# Altium schematic sheet ports.SchDoc
size A4
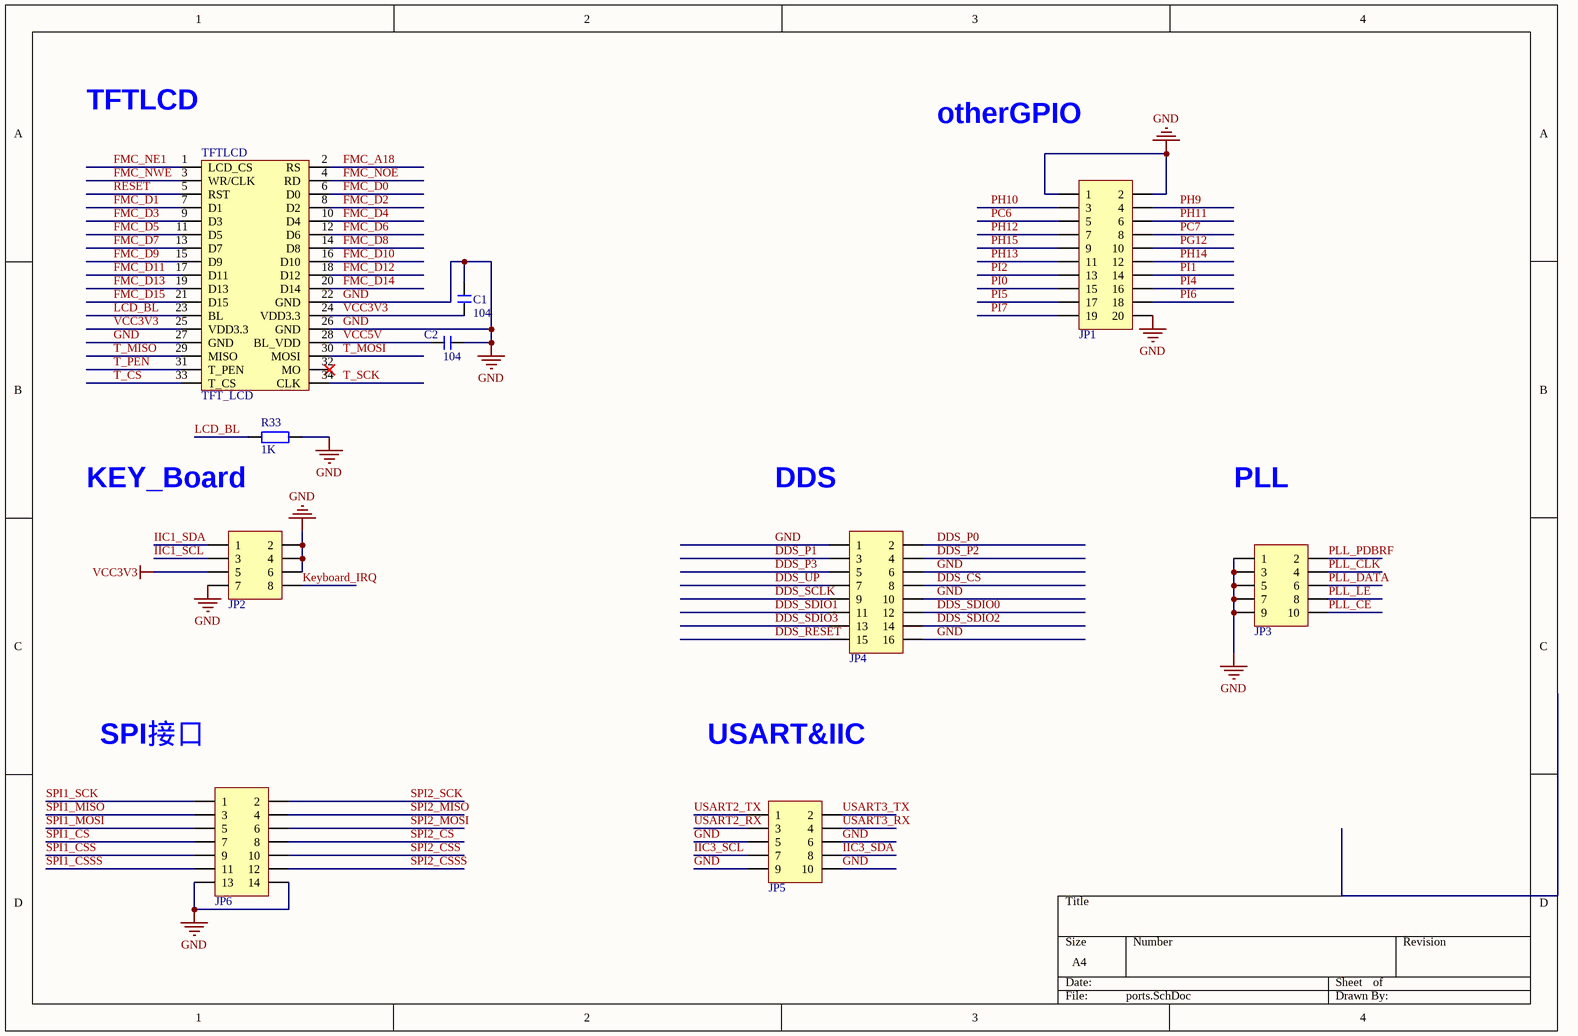
[diagram p0: ports.SchDoc]

## Parts
C1  104  [C 0603_L]
C2  104  [C 0603_L]
JP1  Header 2X10  [IDC2.54-LI-2x10P]  (value not drawn)
JP2  Header 4X2  [IDC2.54-LI-2x4P]  (value not drawn)
JP3  Header 5X2  [IDC2.54-LI-2x5P]  (value not drawn)
JP4  Header 8X2  [IDC2.54-LI-2x8P]  (value not drawn)
JP5  Header 5X2  [IDC2.54-LI-2x5P]  (value not drawn)
JP6  Header 2X7  [IDC2.54-LI-2x7P]  (value not drawn)
R33  1K  [R 0603_L]
TFTLCD  TFT_LCD  [db2*17-4.3]

## Nets
GND: C1.2 C2.1 JP1.1 JP1.2 JP1.20 JP2.2 JP2.4 JP2.6 JP2.7 JP3.1 JP3.3 JP3.5 JP3.7 JP3.9 JP4.1 JP4.6 JP4.10 JP4.16 JP5.5 JP5.6 JP5.9 JP5.10 JP6.13 JP6.14 R33.2 TFTLCD.22(GND) TFTLCD.26(GND) TFTLCD.27(GND)
VCC3V3: C1.1 JP2.5 TFTLCD.24(VDD3.3) TFTLCD.25(VDD3.3)
DDS_CS: JP4.8
DDS_P0: JP4.2
DDS_P1: JP4.3
DDS_P2: JP4.4
DDS_P3: JP4.5
DDS_RESET: JP4.15
DDS_SCLK: JP4.9
DDS_SDIO0: JP4.12
DDS_SDIO1: JP4.11
DDS_SDIO2: JP4.14
DDS_SDIO3: JP4.13
DDS_UP: JP4.7
FMC_A18: TFTLCD.2(RS)
FMC_D0: TFTLCD.6(D0)
FMC_D1: TFTLCD.7(D1)
FMC_D2: TFTLCD.8(D2)
FMC_D3: TFTLCD.9(D3)
FMC_D4: TFTLCD.10(D4)
FMC_D5: TFTLCD.11(D5)
FMC_D6: TFTLCD.12(D6)
FMC_D7: TFTLCD.13(D7)
FMC_D8: TFTLCD.14(D8)
FMC_D9: TFTLCD.15(D9)
FMC_D10: TFTLCD.16(D10)
FMC_D11: TFTLCD.17(D11)
FMC_D12: TFTLCD.18(D12)
FMC_D13: TFTLCD.19(D13)
FMC_D14: TFTLCD.20(D14)
FMC_D15: TFTLCD.21(D15)
FMC_NE1: TFTLCD.1(LCD_CS)
FMC_NOE: TFTLCD.4(RD)
FMC_NWE: TFTLCD.3(WR/CLK)
IIC1_SCL: JP2.3
IIC1_SDA: JP2.1
IIC3_SCL: JP5.7
IIC3_SDA: JP5.8
Keyboard_IRQ: JP2.8
LCD_BL: R33.1 TFTLCD.23(BL)
PC6: JP1.5
PC7: JP1.8
PG12: JP1.10
PH9: JP1.4
PH10: JP1.3
PH11: JP1.6
PH12: JP1.7
PH13: JP1.11
PH14: JP1.12
PH15: JP1.9
PI0: JP1.15
PI1: JP1.14
PI2: JP1.13
PI4: JP1.16
PI5: JP1.17
PI6: JP1.18
PI7: JP1.19
PLL_CE: JP3.10
PLL_CLK: JP3.4
PLL_DATA: JP3.6
PLL_LE: JP3.8
PLL_PDBRF: JP3.2
RESET: TFTLCD.5(RST)
SPI1_CS: JP6.7
SPI1_CSS: JP6.9
SPI1_CSSS: JP6.11
SPI1_MISO: JP6.3
SPI1_MOSI: JP6.5
SPI1_SCK: JP6.1
SPI2_CS: JP6.8
SPI2_CSS: JP6.10
SPI2_CSSS: JP6.12
SPI2_MISO: JP6.4
SPI2_MOSI: JP6.6
SPI2_SCK: JP6.2
T_CS: TFTLCD.33(T_CS)
T_MISO: TFTLCD.29(MISO)
T_MOSI: TFTLCD.30(MOSI)
T_PEN: TFTLCD.31(T_PEN)
T_SCK: TFTLCD.34(CLK)
USART2_RX: JP5.3
USART2_TX: JP5.1
USART3_RX: JP5.4
USART3_TX: JP5.2
VCC5V: C2.2 TFTLCD.28(BL_VDD)

Not connected (* = marked no-connect by the designer): TFTLCD 32(MO)*

## Notes on the sheet
- TFTLCD
- otherGPIO
- KEY_Board
- DDS
- PLL
- SPI接口
- USART&IIC

## Library data of the parts
C1 C2 = C: 无极性贴片电容; 版权归属: 源创客; BOM名称: 无极性贴片电容; 学习资源: www.ooocke.com
JP1 = Header 10X2: 10*2P接插件; 版权归属: 源创客; BOM名称: 10*2P接插件; 学习资源: www.ooocke.com
JP2 = Header 4X2: 4*2P接插件; 版权归属: 源创客; BOM名称: 4*2P接插件; 学习资源: www.ooocke.com
JP3 JP5 = Header 5X2: 5*2P接插件; 版权归属: 源创客; BOM名称: 5*2P接插件; 学习资源: www.ooocke.com
JP4 = Header 8X2: 8*2P接插件; 版权归属: 源创客; BOM名称: 8*2P接插件; 学习资源: www.ooocke.com
JP6 = Header 7X2: 7*2P接插件; 版权归属: 源创客; BOM名称: 7*2P接插件; 学习资源: www.ooocke.com
R33 = R: 贴片电阻; 版权归属: 源创客; BOM名称: 贴片电阻; 学习资源: www.ooocke.com